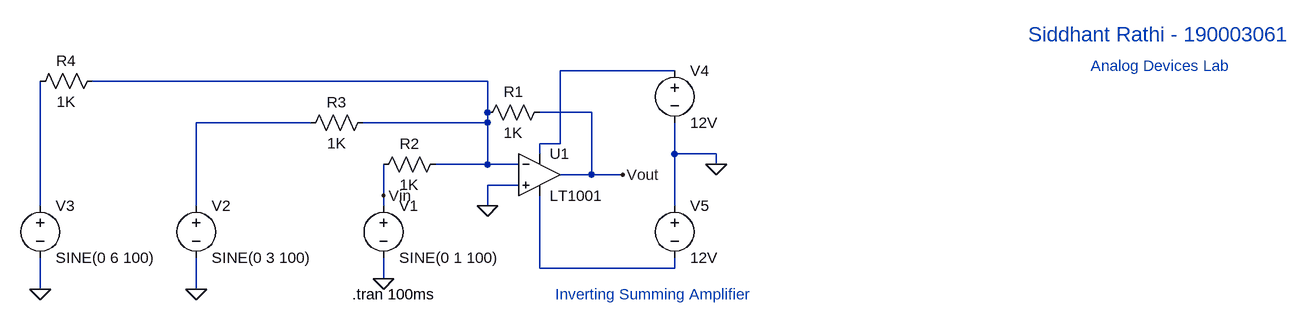
[diagram p0: schematic invertingSummer.asc]
invertingSummer.asc, the LTspice schematic file:
Version 4
SHEET 1 1240 680
WIRE 256 16 80 16
WIRE -32 32 -640 32
WIRE -32 80 -32 32
WIRE 128 80 48 80
WIRE -304 96 -480 96
WIRE -32 96 -32 80
WIRE -32 96 -224 96
WIRE 80 128 80 16
WIRE 80 128 48 128
WIRE 48 144 48 128
WIRE 256 144 256 96
WIRE 320 144 256 144
WIRE -32 160 -32 96
WIRE -32 160 -112 160
WIRE 16 160 -32 160
WIRE 320 160 320 144
WIRE 128 176 128 80
WIRE 128 176 80 176
WIRE 176 176 128 176
WIRE 16 192 -32 192
WIRE -192 208 -192 160
WIRE -720 224 -720 32
WIRE -480 224 -480 96
WIRE -192 224 -192 208
WIRE -32 224 -32 192
WIRE 256 224 256 144
WIRE 48 320 48 208
WIRE 256 320 256 304
WIRE 256 320 48 320
WIRE -192 336 -192 304
WIRE -720 352 -720 304
WIRE -480 352 -480 304
FLAG -32 224 0
FLAG -192 336 0
FLAG -192 208 Vin
FLAG 176 176 Vout
FLAG 320 160 0
FLAG -720 352 0
FLAG -480 352 0
SYMBOL OpAmps\\LT1001 48 112 R0
SYMATTR InstName U1
SYMBOL res 64 64 R90
WINDOW 0 0 56 VBottom 2
WINDOW 3 32 56 VTop 2
SYMATTR InstName R1
SYMATTR Value 1K
SYMBOL res -96 144 R90
WINDOW 0 0 56 VBottom 2
WINDOW 3 32 56 VTop 2
SYMATTR InstName R2
SYMATTR Value 1K
SYMBOL voltage -192 208 R0
WINDOW 123 0 0 Left 0
WINDOW 39 0 0 Left 0
SYMATTR InstName V1
SYMATTR Value SINE(0 1 100)
SYMBOL voltage 256 0 R0
WINDOW 123 0 0 Left 0
WINDOW 39 0 0 Left 0
SYMATTR InstName V4
SYMATTR Value 12V
SYMBOL voltage 256 208 R0
WINDOW 123 0 0 Left 0
WINDOW 39 0 0 Left 0
SYMATTR InstName V5
SYMATTR Value 12V
SYMBOL res -208 80 R90
WINDOW 0 0 56 VBottom 2
WINDOW 3 32 56 VTop 2
SYMATTR InstName R3
SYMATTR Value 1K
SYMBOL res -624 16 R90
WINDOW 0 0 56 VBottom 2
WINDOW 3 32 56 VTop 2
SYMATTR InstName R4
SYMATTR Value 1K
SYMBOL voltage -480 208 R0
WINDOW 123 0 0 Left 0
WINDOW 39 0 0 Left 0
SYMATTR InstName V2
SYMATTR Value SINE(0 3 100)
SYMBOL voltage -720 208 R0
WINDOW 123 0 0 Left 0
WINDOW 39 0 0 Left 0
SYMATTR InstName V3
SYMATTR Value SINE(0 6 100)
TEXT -240 360 Left 2 !.tran 100ms
TEXT 800 -40 Left 3 ;Siddhant Rathi - 190003061
TEXT 896 8 Left 2 ;Analog Devices Lab
TEXT 72 360 Left 2 ;Inverting Summing Amplifier

The netlist it stands for:
* invertingSummer.asc
XU1 0 N002 N001 N005 Vout LT1001  ; pins In+ In- V+ V- OUT
R1 Vout N002 1K
R2 N002 Vin 1K
V1 Vin 0 SINE(0 1 100)
V4 N001 0 12V
V5 0 N005 12V
R3 N002 N003 1K
R4 N002 N004 1K
V2 N003 0 SINE(0 3 100)
V3 N004 0 SINE(0 6 100)
.tran 100ms
* Siddhant Rathi - 190003061
* Analog Devices Lab
* Inverting Summing Amplifier
.lib LTC.lib
.backanno
.end